# EAGLE schematic PCB_Eagle (EAGLE 9.2.2)
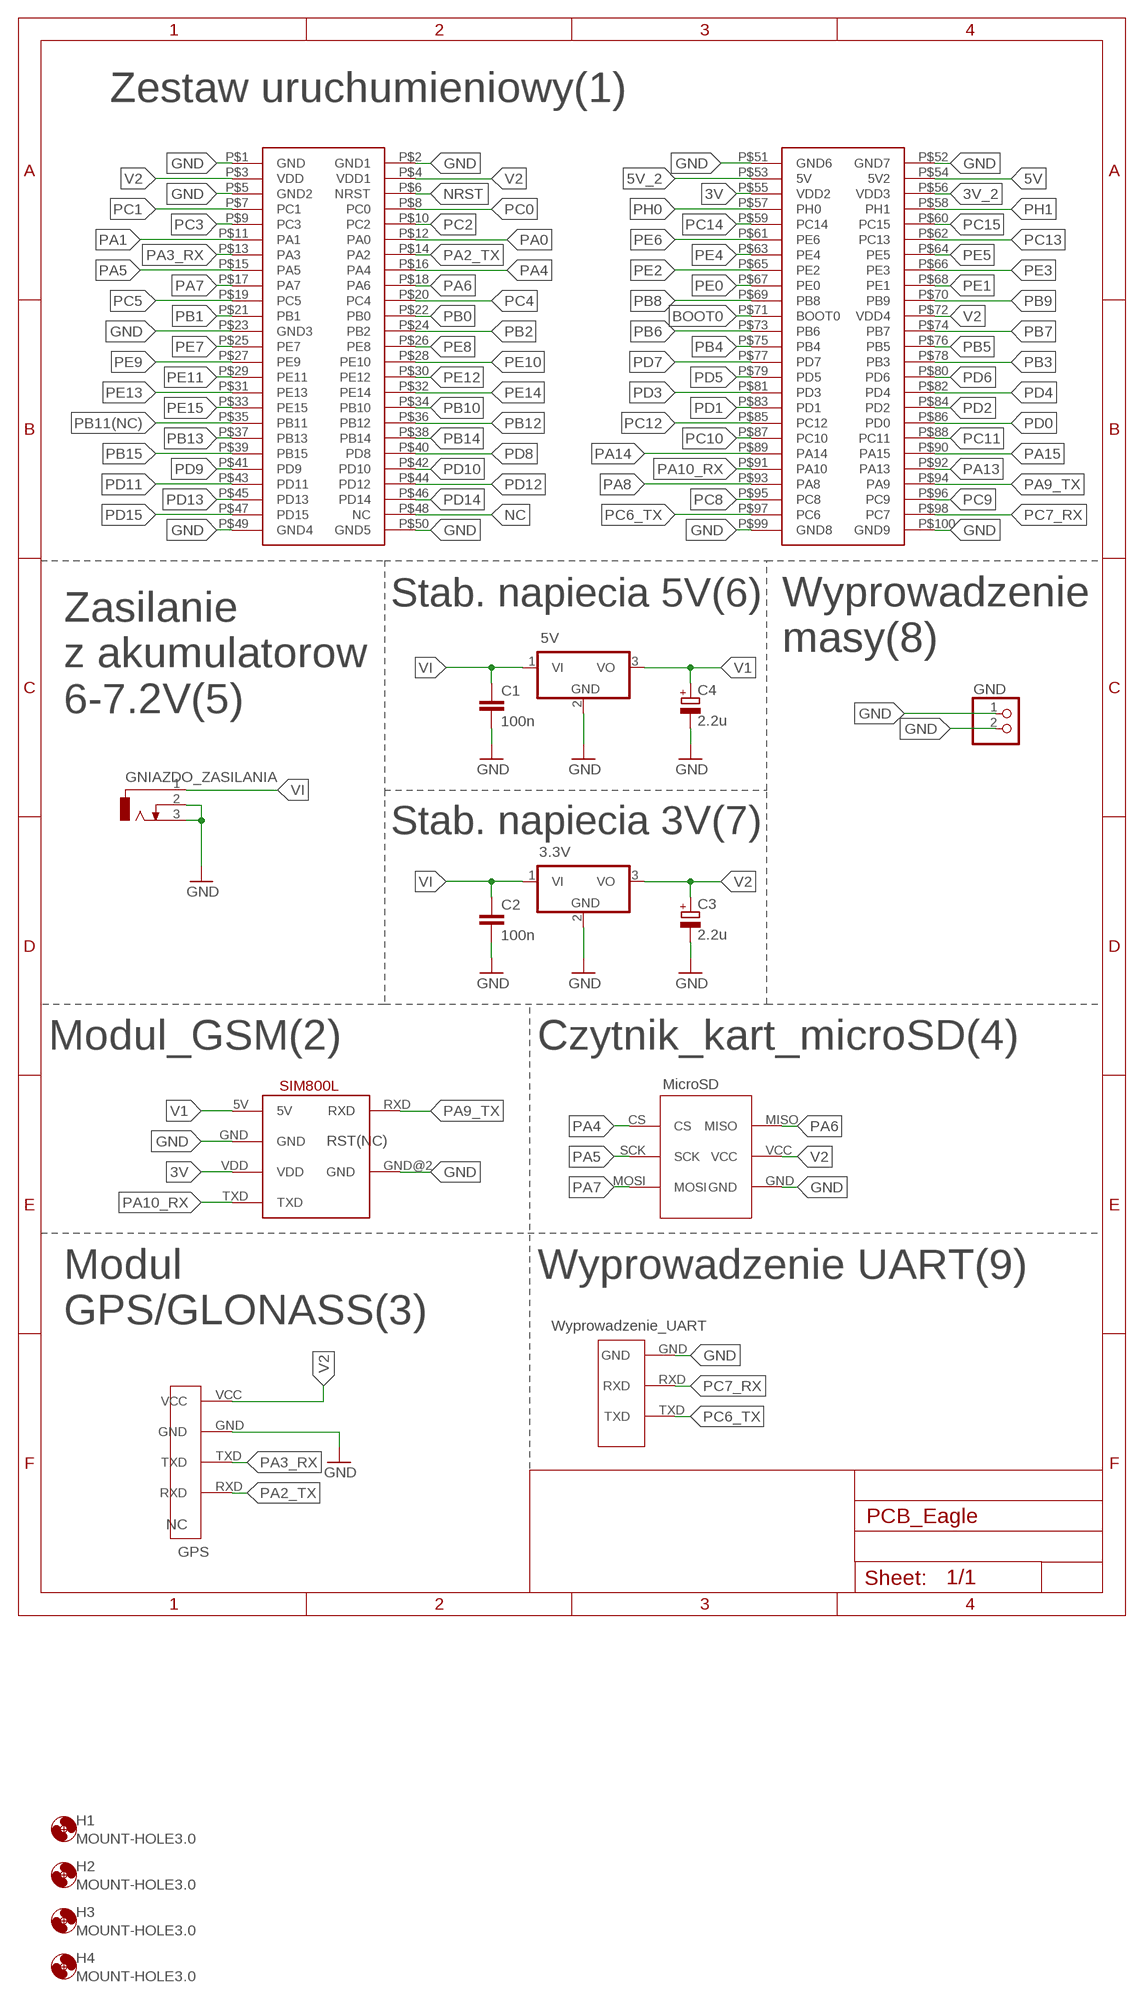
[diagram p0: schematic, sheet 1]

## Parts
3.3V  7805TV  [TO220V]
5V  7805TV  [TO220V]
C1  100n  C-EUC1206K  [C1206K]
C2  100n  C-EUC1206K  [C1206K]
C3  2.2u  CPOL-EUA/3216-18W  [A/3216-18W]
C4  2.2u  CPOL-EUA/3216-18W  [A/3216-18W]
GND  PINHD-1X2  [1X02]
GNIAZDO_ZASILANIA  WEJSCIE_VCC  [DCJ0202]
H1  MOUNT-HOLE3.0  [3,0]
H2  MOUNT-HOLE3.0  [3,0]
H3  MOUNT-HOLE3.0  [3,0]
H4  MOUNT-HOLE3.0  [3,0]
U$1  MODUL_GPS  [MODUL_GPS]
U$3  MODUL_GSM  [MODUL_GSM]
U$4  STM32F4-DISCOVERY  [STM32F4-DISCOVERY]
U$5  WYPROWADZENIE_UART  [WYPROWADZENIE_UART]
U$6  MICROSD  [MICROSD]

## Nets
3V: U$3.VDD U$4.P$55(VDD2)
3V_2: U$4.P$56(VDD3)
5V: U$4.P$54(5V2)
5V_2: U$4.P$53(5V)
BOOT0: U$4.P$71(BOOT0)
GND: 3.3V.2(GND) 5V.2(GND) C1.2 C2.2 C3.- C4.- GND.1 GND.2 GNIAZDO_ZASILANIA.2 GNIAZDO_ZASILANIA.3 U$1.GND U$3.GND U$3.GND@2(GND) U$4.P$1(GND) U$4.P$2(GND1) U$4.P$5(GND2) U$4.P$23(GND3) U$4.P$49(GND4) U$4.P$50(GND5) U$4.P$51(GND6) U$4.P$52(GND7) U$4.P$99(GND8) U$4.P$100(GND9) U$5.GND U$6.GND
NC: U$4.P$48(NC)
NRST: U$4.P$6(NRST)
PA0: U$4.P$12(PA0)
PA1: U$4.P$11(PA1)
PA2_TX: U$1.RXD U$4.P$14(PA2)
PA3_RX: U$1.TXD U$4.P$13(PA3)
PA4: U$4.P$16(PA4) U$6.CS
PA5: U$4.P$15(PA5) U$6.SCK
PA6: U$4.P$18(PA6) U$6.MISO
PA7: U$4.P$17(PA7) U$6.MOSI
PA8: U$4.P$93(PA8)
PA9_TX: U$3.RXD U$4.P$94(PA9)
PA10_RX: U$3.TXD U$4.P$91(PA10)
PA13: U$4.P$92(PA13)
PA14: U$4.P$89(PA14)
PA15: U$4.P$90(PA15)
PB0: U$4.P$22(PB0)
PB1: U$4.P$21(PB1)
PB2: U$4.P$24(PB2)
PB3: U$4.P$78(PB3)
PB4: U$4.P$75(PB4)
PB5: U$4.P$76(PB5)
PB6: U$4.P$73(PB6)
PB7: U$4.P$74(PB7)
PB8: U$4.P$69(PB8)
PB9: U$4.P$70(PB9)
PB10: U$4.P$34(PB10)
PB11(NC): U$4.P$35(PB11)
PB12: U$4.P$36(PB12)
PB13: U$4.P$37(PB13)
PB14: U$4.P$38(PB14)
PB15: U$4.P$39(PB15)
PC0: U$4.P$8(PC0)
PC1: U$4.P$7(PC1)
PC2: U$4.P$10(PC2)
PC3: U$4.P$9(PC3)
PC4: U$4.P$20(PC4)
PC5: U$4.P$19(PC5)
PC6_TX: U$4.P$97(PC6) U$5.TXD
PC7_RX: U$4.P$98(PC7) U$5.RXD
PC8: U$4.P$95(PC8)
PC9: U$4.P$96(PC9)
PC10: U$4.P$87(PC10)
PC11: U$4.P$88(PC11)
PC12: U$4.P$85(PC12)
PC13: U$4.P$62(PC13)
PC14: U$4.P$59(PC14)
PC15: U$4.P$60(PC15)
PD0: U$4.P$86(PD0)
PD1: U$4.P$83(PD1)
PD2: U$4.P$84(PD2)
PD3: U$4.P$81(PD3)
PD4: U$4.P$82(PD4)
PD5: U$4.P$79(PD5)
PD6: U$4.P$80(PD6)
PD7: U$4.P$77(PD7)
PD8: U$4.P$40(PD8)
PD9: U$4.P$41(PD9)
PD10: U$4.P$42(PD10)
PD11: U$4.P$43(PD11)
PD12: U$4.P$44(PD12)
PD13: U$4.P$45(PD13)
PD14: U$4.P$46(PD14)
PD15: U$4.P$47(PD15)
PE0: U$4.P$67(PE0)
PE1: U$4.P$68(PE1)
PE2: U$4.P$65(PE2)
PE3: U$4.P$66(PE3)
PE4: U$4.P$63(PE4)
PE5: U$4.P$64(PE5)
PE6: U$4.P$61(PE6)
PE7: U$4.P$25(PE7)
PE8: U$4.P$26(PE8)
PE9: U$4.P$27(PE9)
PE10: U$4.P$28(PE10)
PE11: U$4.P$29(PE11)
PE12: U$4.P$30(PE12)
PE13: U$4.P$31(PE13)
PE14: U$4.P$32(PE14)
PE15: U$4.P$33(PE15)
PH0: U$4.P$57(PH0)
PH1: U$4.P$58(PH1)
V1: 5V.3(VO) C4.+ U$3.5V
V2: 3.3V.3(VO) C3.+ U$1.VCC U$4.P$3(VDD) U$4.P$4(VDD1) U$4.P$72(VDD4) U$6.VCC
VI: 3.3V.1(VI) 5V.1(VI) C1.1 C2.1 GNIAZDO_ZASILANIA.1

## Notes on the sheet
- Zestaw uruchumieniowy(1)
- Stab. napiecia 5V(6)
- Wyprowadzenie
  masy(8)
- Zasilanie 
  z akumulatorow
  6-7.2V(5)
- Stab. napiecia 3V(7)
- Modul_GSM(2) | Czytnik_kart_microSD(4)
- Wyprowadzenie UART(9)
- Modul
  GPS/GLONASS(3)

## Library data of the parts
3.3V 5V = linear:78*: Positive VOLTAGE REGULATOR Source: http://cache.national.com/ds/LM/LM78L05.pdf http://www.fairchildsemi.com/ds/LM/LM7805.pdf
C1 C2 = rcl:C-EU: CAPACITOR, European symbol; SPICEPREFIX: C
C3 C4 = rcl:CPOL-EU: POLARIZED CAPACITOR, European symbol; SPICEPREFIX: C
GND = pinhead:PINHD-1X2: PIN HEADER
GNIAZDO_ZASILANIA = Mateusz_uC:WEJSCIE_VCC
H1-H4 = holes:MOUNT-HOLE: MOUNTING HOLE with drill center marker
U$1 = Mateusz_uC:MODUL_GPS
U$3 = Mateusz_uC:MODUL_GSM
U$4 = Mateusz_uC:STM32F4-DISCOVERY
U$5 = Mateusz_uC:WYPROWADZENIE_UART
U$6 = Mateusz_uC:MICROSD